# EAGLE design Adafruit MPU6050 (EAGLE 9.6.2)
COMPANY: ADAFRUIT INDUSTRIES; DRAWN: KTOWN; REV: A; YEAR: 2019
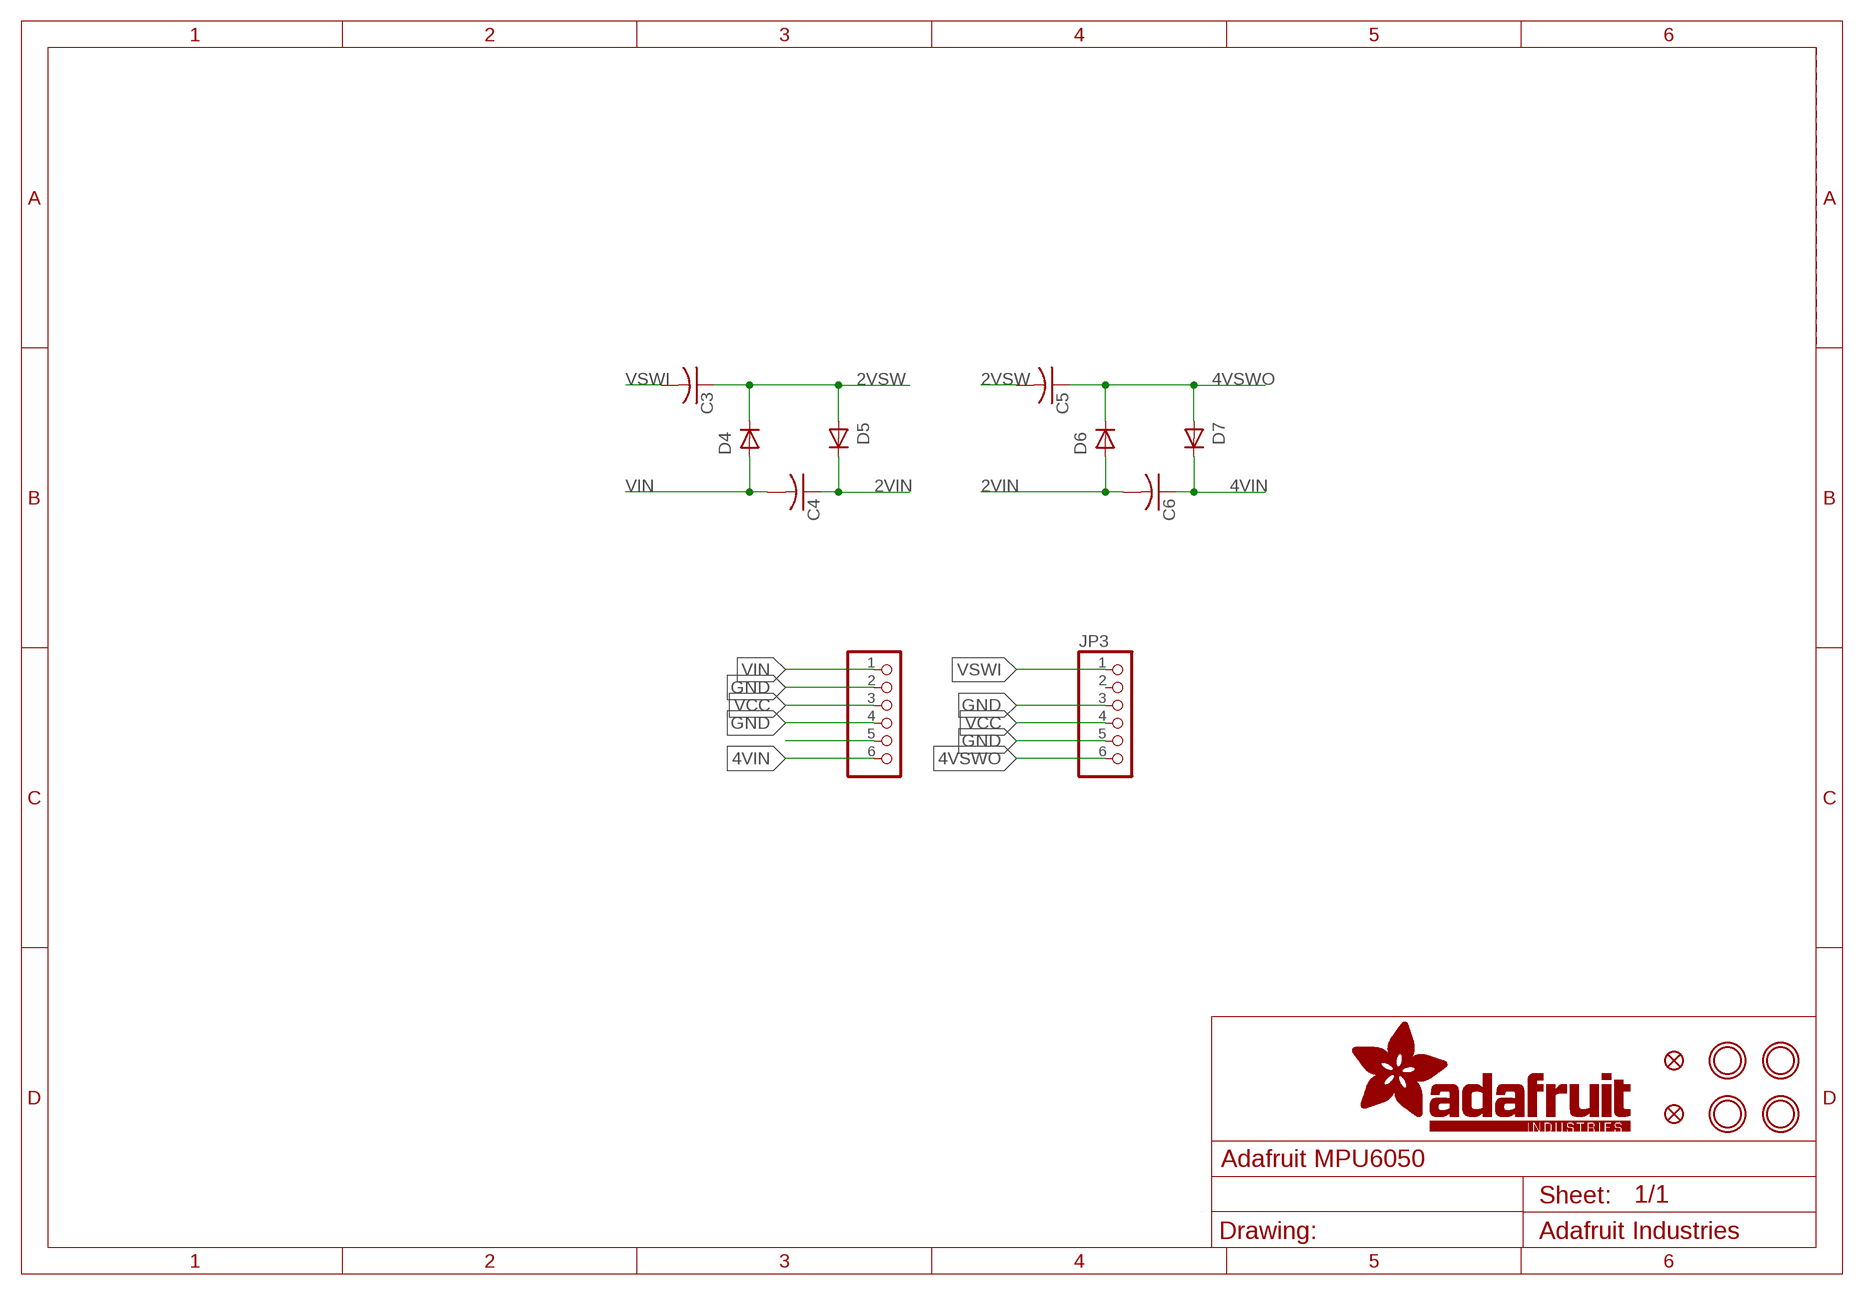
[diagram p0: schematic, sheet 1]

## Parts
C3  C-USC0603  [C0603]
C4  C-USC0603  [C0603]
C5  C-USC0603  [C0603]
C6  C-USC0603  [C0603]
D4  DI-BAS21LD  [SOD882D]
D5  DI-BAS21LD  [SOD882D]
D6  DI-BAS21LD  [SOD882D]
D7  DI-BAS21LD  [SOD882D]
FID3  FIDUCIAL_1MM  [FIDUCIAL_1MM]
FID4  FIDUCIAL_1MM  [FIDUCIAL_1MM]
JP2  HEADER-1X6ROUND  [1X06_ROUND]
JP3  HEADER-1X670MIL  [1X06_ROUND_70]
U$39  MOUNTINGHOLE2.5  [MOUNTINGHOLE_2.5_PLATED]
U$40  MOUNTINGHOLE2.5  [MOUNTINGHOLE_2.5_PLATED]
U$42  MOUNTINGHOLE2.5  [MOUNTINGHOLE_2.5_PLATED]
U$43  MOUNTINGHOLE2.5  [MOUNTINGHOLE_2.5_PLATED]

## Nets
2VIN: C4.1 C6.2 D5.K D6.A
2VSW: C3.1 C5.2 D4.K D5.A
4VIN: C6.1 D7.K JP2.6
4VSWO: C5.1 D6.K D7.A JP3.6
GND: JP2.2 JP2.4 JP3.3 JP3.5
N$1: JP2.5
VCC: JP2.3 JP3.4
VIN: C4.2 D4.A JP2.1
VSWI: C3.2 JP3.1
Unconnected: JP3.2

## Library data of the parts
C3-C6 = RLC:C-US: CAPACITOR, American symbol; ARROW_PN: ?; DATASHEET: ?; DESCRIPTION: ?; DIGI-KEY_PN: ?; MANUFACTURER: ?; MOUSER_PN: ?; PACKAGE: ?; PART_NUMBER: ?; SPICEPREFIX: C; TEMP_HIGH: ?; TEMP_LOW: ?; TOLERANCE: ?; TYPE: ?; WEIGHT_MG: 4.7
D4-D7 = hv-gen:DI-BAS21LD; ARROW_PN: ?; DATASHEET: https://assets.nexperia.com/documents/data-sheet/BAS21LD.pdf; DESCRIPTION: HV-SW DIODE 200V 330MA 100NA 50NS; DIGI-KEY_PN: 1727-7663-2-ND; MANUFACTURER: Nexperia; MOUSER_PN: 771-BAS21LDYL; PACKAGE: DFN-1006-2; PART_NUMBER: BAS21LDYL; TEMP_HIGH: 150C; TEMP_LOW: -65C; TOLERANCE: ?; TYPE: SMA; WEIGHT_MG: 1
FID3 FID4 = microbuilder:FIDUCIAL: Fiducial Alignment Points Various fiducial points for machine vision alignment.; BOM: EXCLUDE
JP2 JP3 = microbuilder:HEADER-1X6: PIN HEADER
U$39 U$40 U$42 U$43 = microbuilder:MOUNTINGHOLE: Mounting Hole For #2 screws (0.086"/2.18mm width, 0.094"/2.4mm hole) use 2.5mm; BOM: EXCLUDE

## Net classes
1 highpower: width 0.406 mm, drill 0.483 mm
2 lowpower: width 0.305 mm, drill 0.483 mm

## Board
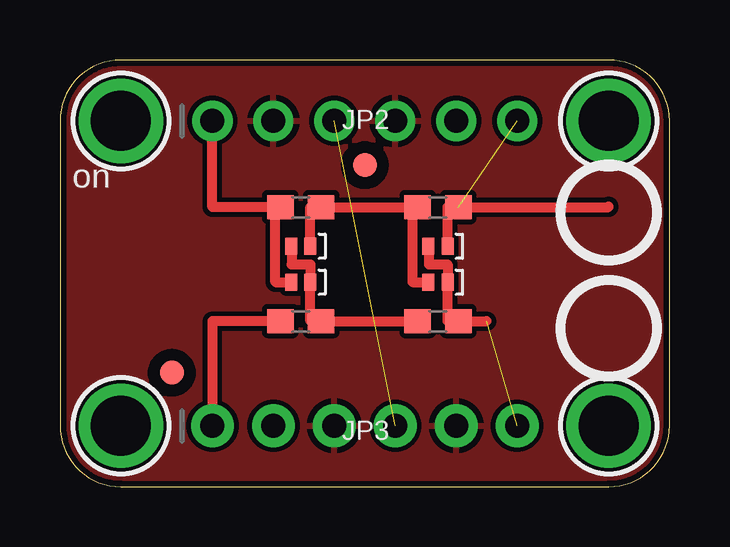
[diagram p1: board, top side]
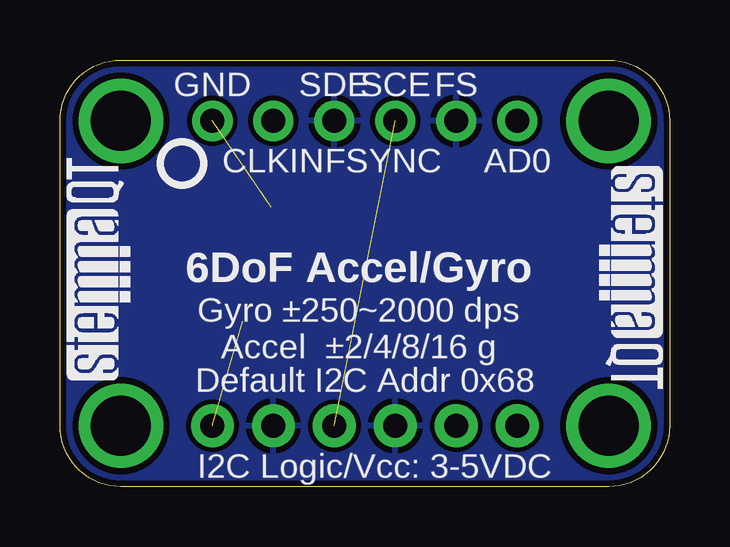
[diagram p2: board, bottom side, seen from below]

Size 25.4 x 17.78 mm. Coordinates in mm from the lower left corner, seen from the top.
Outline: 0,15.24 0,2.54 arc90 2.54,0 22.86,0 arc90 25.4,2.54 25.4,15.24 arc90 22.86,17.78 2.54,17.78 arc90 0,15.24
Copper layers (1*16): Top 0.035mm / dielectric 1.5mm / Bottom 0.035mm
Design rules "adafruit 7-7": minimum track width 6mil, minimum drill 15.5mil, track to track 8mil, track to pad 7mil, pad to pad 7mil, via to via 7mil, smd to smd 7mil, copper to edge 10mil, drill to drill 8mil, minimum pad ring 10mil, minimum via ring 8mil, stop-mask expansion 2mil, vias tented up to drill 20mil, thermal gap 10mil

### Footprints (pad centres in the part's own frame; a part is rotated, then mirrored left to right if it is on the bottom)
C0603 = smd 1.1 x 1: 1 -0.85,0; 2 0.85,0
SOD882D = smd 0.5 x 0.7: A -0.4,0; K 0.4,0
FIDUCIAL_1MM = smd 1 x 1: 1 0,0
1X06_ROUND = drill 1 pad 1.676: 1 -6.35,0; 2 -3.81,0; 3 -1.27,0; 4 1.27,0; 5 3.81,0; 6 6.35,0
1X06_ROUND_70 = drill 1 pad 1.778: 1 -6.35,0; 2 -3.81,0; 3 -1.27,0; 4 1.27,0; 5 3.81,0; 6 6.35,0
MOUNTINGHOLE_2.5_PLATED = drill 2.5 pad 3.2: P$1 0,0

### Placement (x,y rotation side)
C3  10.03,6.9 180 top
C4  10.03,11.65 180 top
C5  15.75,6.9 180 top
C6  15.75,11.65 180 top
D4  10.03,8.52 0 top
D5  10.03,10.02 0 top
D6  15.75,8.52 0 top
D7  15.75,10.02 0 top
FID3  12.7,13.4 0 top
FID4  4.66,4.75 0 top
JP2  12.7,15.24 0 top
JP3  12.7,2.54 0 top
U$39  2.54,15.24 0 top
U$40  22.86,15.24 0 top
U$42  2.54,2.54 0 top
U$43  22.86,2.54 0 top
U$46  [PCBFEAT-REV-040]  20.32,13.46 0 bottom
U$47  [STEMMAQT]  22.48,4.45 90 bottom
U$48  [STEMMAQT]  2.92,13.34 270 bottom

### Tracks (layer width: path | path; a pad name or v marks a point on that pad's centre or on a via)
2VIN
  Top 0.406: D5.K 10.43,11.65 C4.1 C6.2 14.77,11.65 14.69,11.57 14.69,8.52 D6.A
2VSW
  Top 0.406: D5.A 9.65,10.02 9.65,9.27 10.43,9.27 D4.K 10.43,6.9 C3.1 C5.2
4VIN  (1 unrouted)
  Top 0.406: D7.K 16.15,11.65 C6.1 22.86,11.65 22.86,11.68
4VSWO  (1 unrouted)
  Top 0.406: D7.A 15.37,10.02 15.37,9.27 16.15,9.27 D6.K 16.15,6.9 C5.1 17.78,6.9
GND
  pour Top: 0,17.78 25.4,17.78 25.4,0 0,0
  pour Bottom: 0,17.78 25.4,17.78 25.4,0 0,0
VCC  (1 unrouted)
VIN
  Top 0.406: D4.A 8.98,8.52 8.98,11.57 9.06,11.65 C4.2 6.35,11.65 JP2.1
VSWI
  Top 0.406: JP3.1 6.35,6.9 C3.2

### Text on the board
tPlace: on
bPlace: FS | SCE | SDE | GND | AD0 | FSYNC | CLKIN | 6DoF Accel/Gyro | Gyro ±250~2000 dps | Accel ±2/4/8/16 g | Default I2C Addr 0x68 | I2C Logic/Vcc: 3-5VDC
tNames: <---- Test plug connectors here
Document: OUT | IN | IN | OUT